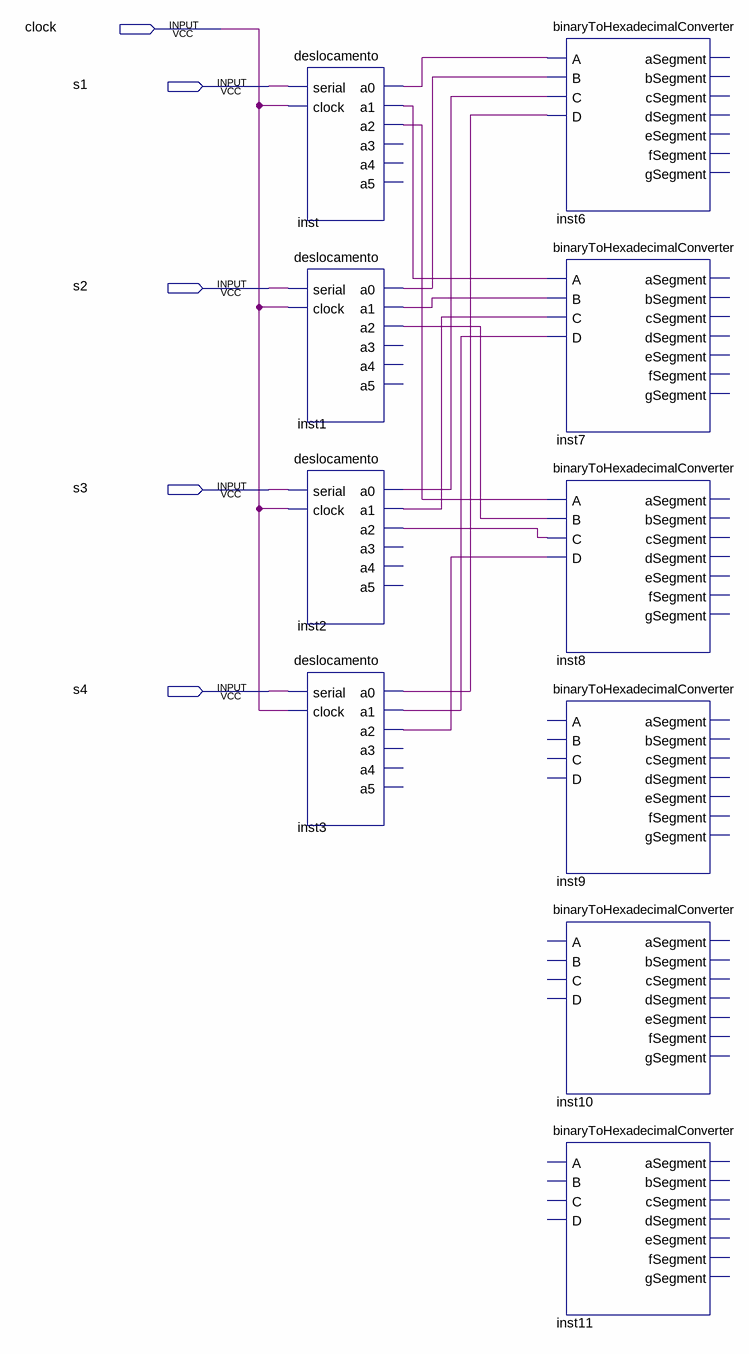
[diagram p0: schematic sheet]
// Quartus schematic deslocamentoGrande.bdf as structural Verilog: 10 symbols, 5 pins
module deslocamentoGrande (
  input  clock,
  input  s1,
  input  s2,
  input  s3,
  input  s4
);

  wire inst1_a0, inst1_a1, inst1_a2, inst2_a0, inst2_a1, inst2_a2, inst3_a0, inst3_a1, inst3_a2, inst_a0,
       inst_a1, inst_a2;

  deslocamento inst (.serial(s1), .clock(clock), .a0(inst_a0), .a1(inst_a1), .a2(inst_a2));  // open: a3, a4, a5
  deslocamento inst1 (.serial(s2), .clock(clock), .a0(inst1_a0), .a1(inst1_a1), .a2(inst1_a2));  // open: a3, a4, a5
  deslocamento inst2 (.serial(s3), .clock(clock), .a0(inst2_a0), .a1(inst2_a1), .a2(inst2_a2));  // open: a3, a4, a5
  deslocamento inst3 (.serial(s4), .clock(clock), .a0(inst3_a0), .a1(inst3_a1), .a2(inst3_a2));  // open: a3, a4, a5
  binaryToHexadecimalConverter inst6 (
    .A(inst_a0), .B(inst1_a0), .C(inst2_a0), .D(inst3_a0));  // open: aSegment, bSegment, cSegment, dSegment, eSegment, fSegment, gSegment
  binaryToHexadecimalConverter inst7 (
    .A(inst_a1), .B(inst1_a1), .C(inst2_a1), .D(inst3_a1));  // open: aSegment, bSegment, cSegment, dSegment, eSegment, fSegment, gSegment
  binaryToHexadecimalConverter inst8 (
    .A(inst_a2), .B(inst1_a2), .C(inst2_a2), .D(inst3_a2));  // open: aSegment, bSegment, cSegment, dSegment, eSegment, fSegment, gSegment
  binaryToHexadecimalConverter inst9 ();  // open: A, B, C, D, aSegment, bSegment, cSegment, dSegment, eSegment, fSegment, gSegment
  binaryToHexadecimalConverter inst10 ();  // open: A, B, C, D, aSegment, bSegment, cSegment, dSegment, eSegment, fSegment, gSegment
  binaryToHexadecimalConverter inst11 ();  // open: A, B, C, D, aSegment, bSegment, cSegment, dSegment, eSegment, fSegment, gSegment
endmodule
